# Altium schematic sheet ha_light_switch-power.SchDoc
size A4; DrawnBy: Emile Renaud; Revision: V1.0; SheetNumber: 3; SheetTotal: 3
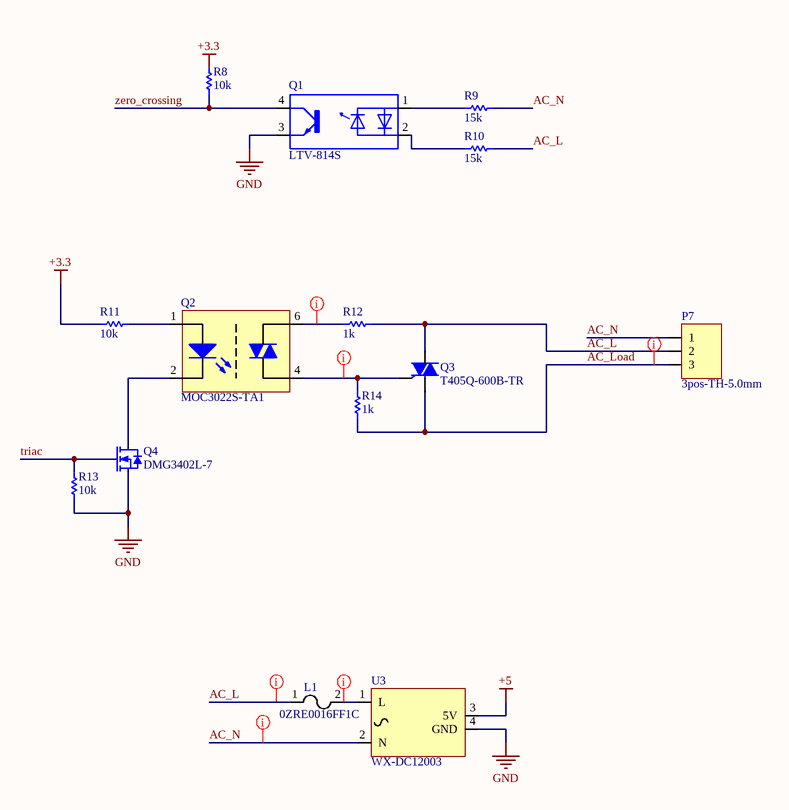
[diagram p0: ha_light_switch-power.SchDoc]

## Parts
L1  0ZRE0016FF1C  [0ZRE0016FF1C-PTC]
P7  3pos-TH-5.0mm  [Weco 3]
Q1  LTV-814S  [SMD-4-LTV814]
Q2  MOC3022S-TA1  [SMD-6]
Q3  T405Q-600B-TR  [TO-252-3/DPAK]
Q4  DMG3402L-7  [SOT-23-3]
R8  value 10k  [Resistor-0603]  (hidden comment: SMT resistor)
R9  value 15k  [RESISTOR-2512]  (hidden comment: SMT resistor)
R10  value 15k  [RESISTOR-2512]  (hidden comment: SMT resistor)
R11  value 10k  [Resistor-0603]  (hidden comment: SMT resistor)
R12  value 1k  [RESISTOR-2512]  (hidden comment: SMT resistor)
R13  value 10k  [Resistor-0603]  (hidden comment: SMT resistor)
R14  value 1k  [RESISTOR-2512]  (hidden comment: SMT resistor)
U3  WX-DC12003  [WX-DC12003]

## Nets
+3.3: R8.2 R11.2
+5: U3.3(5V)
GND: Q1.3 Q4.2(S) R13.2 U3.4(GND)
AC_L: L1.1 P7.2 Q3.2(A2) R10.2 R12.2
AC_Load: P7.3 Q3.1(A1) R14.1
AC_N: P7.1 R9.2 U3.2(N)
triac: Q4.1(G) R13.1
zero_crossing: Q1.4 R8.1
NetL1_2: L1.2 U3.1(L)
NetQ1_1: Q1.1 R9.1
NetQ1_2: Q1.2 R10.1
NetQ2_1: Q2.1(Anode) R11.1
NetQ2_2: Q2.2(Cathode) Q4.3(D)
NetQ2_4: Q2.4(GND) Q3.3(G) R14.2
NetQ2_6: Q2.6(Vdd) R12.1

## Layout directives
net class AC: AC_L, AC_Load, AC_N, NetL1_2, NetQ2_4, NetQ2_6

## Notes on the sheet
- Title:
- Date:
- Size:
- B
- Drawn by:
- Checked by:
- Sheet
- of
- Revision:
- File:

## Library data of the parts
L1 = 0ZRE0016FF1C: PTC RESET FUSE 240V 160MA RADIAL; Current: 5A; Precision: 20%; Supplier 1: Digi-Key; Mounted: Yes; Supplier Part Number 1: 308-2498-1-ND; Package / Case: SMD
P7 = 3P-TH-5.0mm: 3pos-TH-5.0mm Screw Terminal; Supplier 1: Digi-Key; Supplier Part Number 1: 277-1667-ND; Mounted: Yes; Package / Case: TH; Volt: N/A
Q1 = LTV-814S: Optoisolator Transistor Output 5000Vrms 1 Channel 4-SMD; Supplier 1: Digi-Key; Supplier Part Number 1: 160-LTV-814S-TA1-ACT-ND; Package / Case: 4-SMD; Mounted: Yes
Q2 = MOC3022S-TA1: OPTOISOLATOR 5KV TRIAC 6SMD; Supplier 1: Digi-Key; Supplier Part Number 1: 160-2046-1-ND; Package / Case: 6-SMD; Mounted: Yes
Q3 = T405Q-600B-TR: TRIAC SENS GATE 600V 4A DPAK; Supplier 1: Digi-Key; Supplier Part Number 1: 497-2501-1-ND; Volt: 600V; Package / Case: TO-252-3; Mounted: Yes; Current: 4A
Q4 = DMG3402L-7: N-Channel 30 V 4A (Ta) 1.4W (Ta) Surface Mount SOT-23-3; Volt: 30V; Supplier 1: Digi-Key; Supplier Part Number 1: DMG3402L-7DICT-ND; Package / Case: SOT-23-3; Mounted: Yes; Current: 4A
R8 R11 R13 = Resistor-0603-10k: Resistor0603-10k; Precision: 1%; Watt: 0.1W; Mounted: Yes; Package / Case: Metric 1608, EIA 0603; Supplier 1: Digi-Key; Supplier Part Number 1: 311-10.0KHRTR-ND
R9 R10 = Resistor-2512-15k: Precision: 1%; Watt: 1W; Mounted: Yes; Package / Case: Metric 6432,  EIA 2512; Supplier 1: Digi-Key; Supplier Part Number 1: 541-15.0KAFCT-ND
R12 R14 = Resistor-2512-1k: Precision: 1%; Watt: 1W; Mounted: Yes; Package / Case: Metric 6432,  EIA 2512; Supplier 1: Digi-Key; Supplier Part Number 1: 541-1.00KAFCT-ND
U3 = WX-DC12003: AC/DC Isolated converter. 50-277AC -> 5Vdc; Grade: None; Supplier 1: Aliexpress; Supplier Part Number 1: WX-DC12003; HelpURL: https://www.aerial.net/shop/product/54_250/2321/85265v-ac-to-5v.html